# Altium schematic sheet Sheet1.SchDoc
size 420 x 297 mm; SheetNumber: 1; SheetTotal: 1
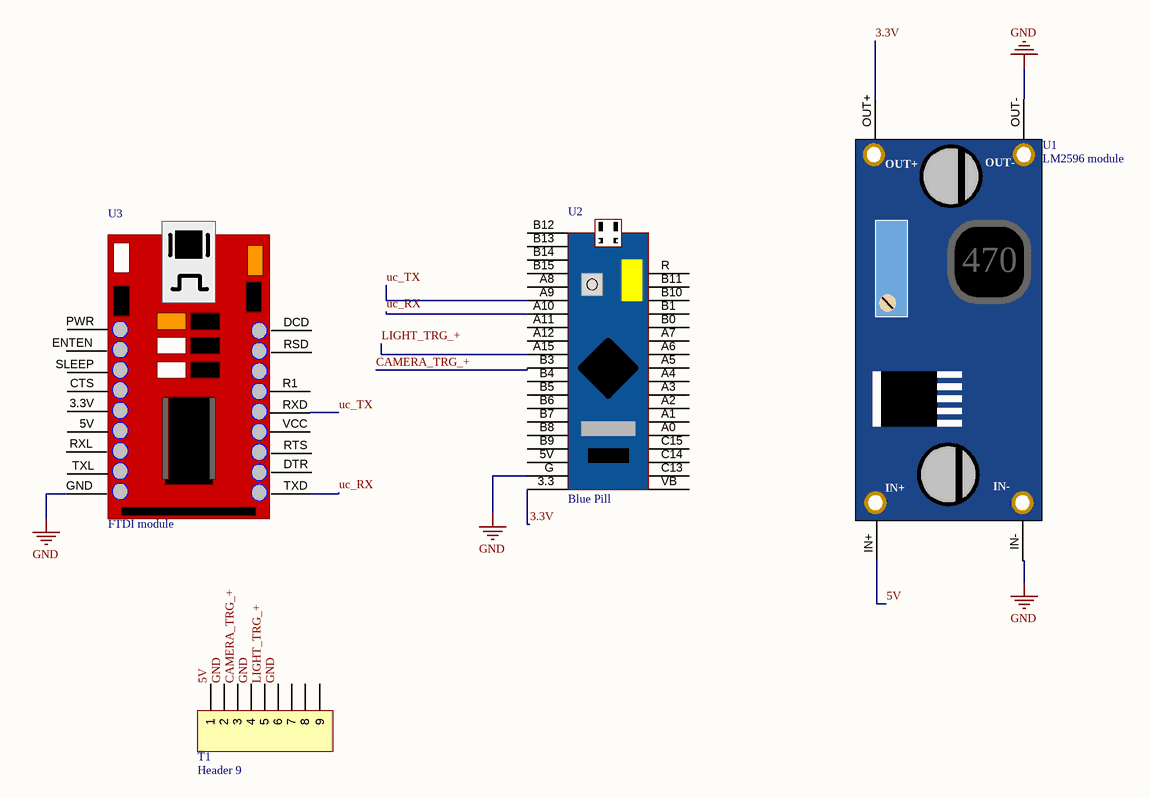
[diagram p0: Sheet1.SchDoc]

## Parts
T1  Header 9  [1X09]
U1  LM2596 module  [LM2596 module]
U2  Blue Pill  [Blue Pill]
U3  FTDI module  [FTDI module]

## Nets
GND: T1.2 T1.4 T1.6 U1.IN- U1.OUT- U2.G U3.GND
3.3V: U1.OUT+(VB) U2.3.3
5V: T1.1 U1.IN+
CAMERA_TRG_+: T1.3 U2.B3
LIGHT_TRG_+: T1.5 U2.A15
uc_RX: U2.A10 U3.TXD
uc_TX: U2.A9 U3.RXD

Not connected (* = marked no-connect by the designer): T1 7 8 9; U2 5V(18) A0(25) A1(26) A2(27) A3(28) A4(29) A5(30) A6(31) A7(32) A8 A11(8) A12(9) B0(33) B1(34) B4(12) B5(13) B6(14) B7(15) B8(16) B9(17) B10(35) B11(36) B12 B13 B14 B15 C13(22) C14(23) C15(24) R(37) VB(21); U3 3.3V 5V CTS DCD DTR ENTEN PWR R1 RSD RTS RXL SLEEP TXL VCC

## Notes on the sheet
- THIS DOCUMENT AND THE DATA DISCLOSED HEREIN OR
- HEREWITH IS THE PROPERTY OF ALTIUM LIMITED AND MAY
- DWG NO:
- REVISION
- REV:
- DESCRIPTION
- DATE
- APPROVED
- BE FREELY DISTRIBUTED IN WHOLE. NO RIGHTS ARE
- RESERVED OR EXPRESS OR IMPLIED WARANTEE GIVEN.
- ENG:
- APPROVALS
- PROJECT
- DSN:
- CHK:
- REFERENCE DOCUMENTS
- PROJECT REVISION:
- TITLE
- DOCUMENT REVISION:
- DESIGN ITEM:
- BOM:
- FAB DWG:
- PCB DWG:
- ASSY DWG:
- SCALE:
- A3
- SIZE
- CAGE CODE
- FILE NAME
- DWG NO.
- SHEET
- OF
- REV
- (in symbol LM2596 module) 470